# EAGLE design PiTlnfo (EAGLE 6.5.0)
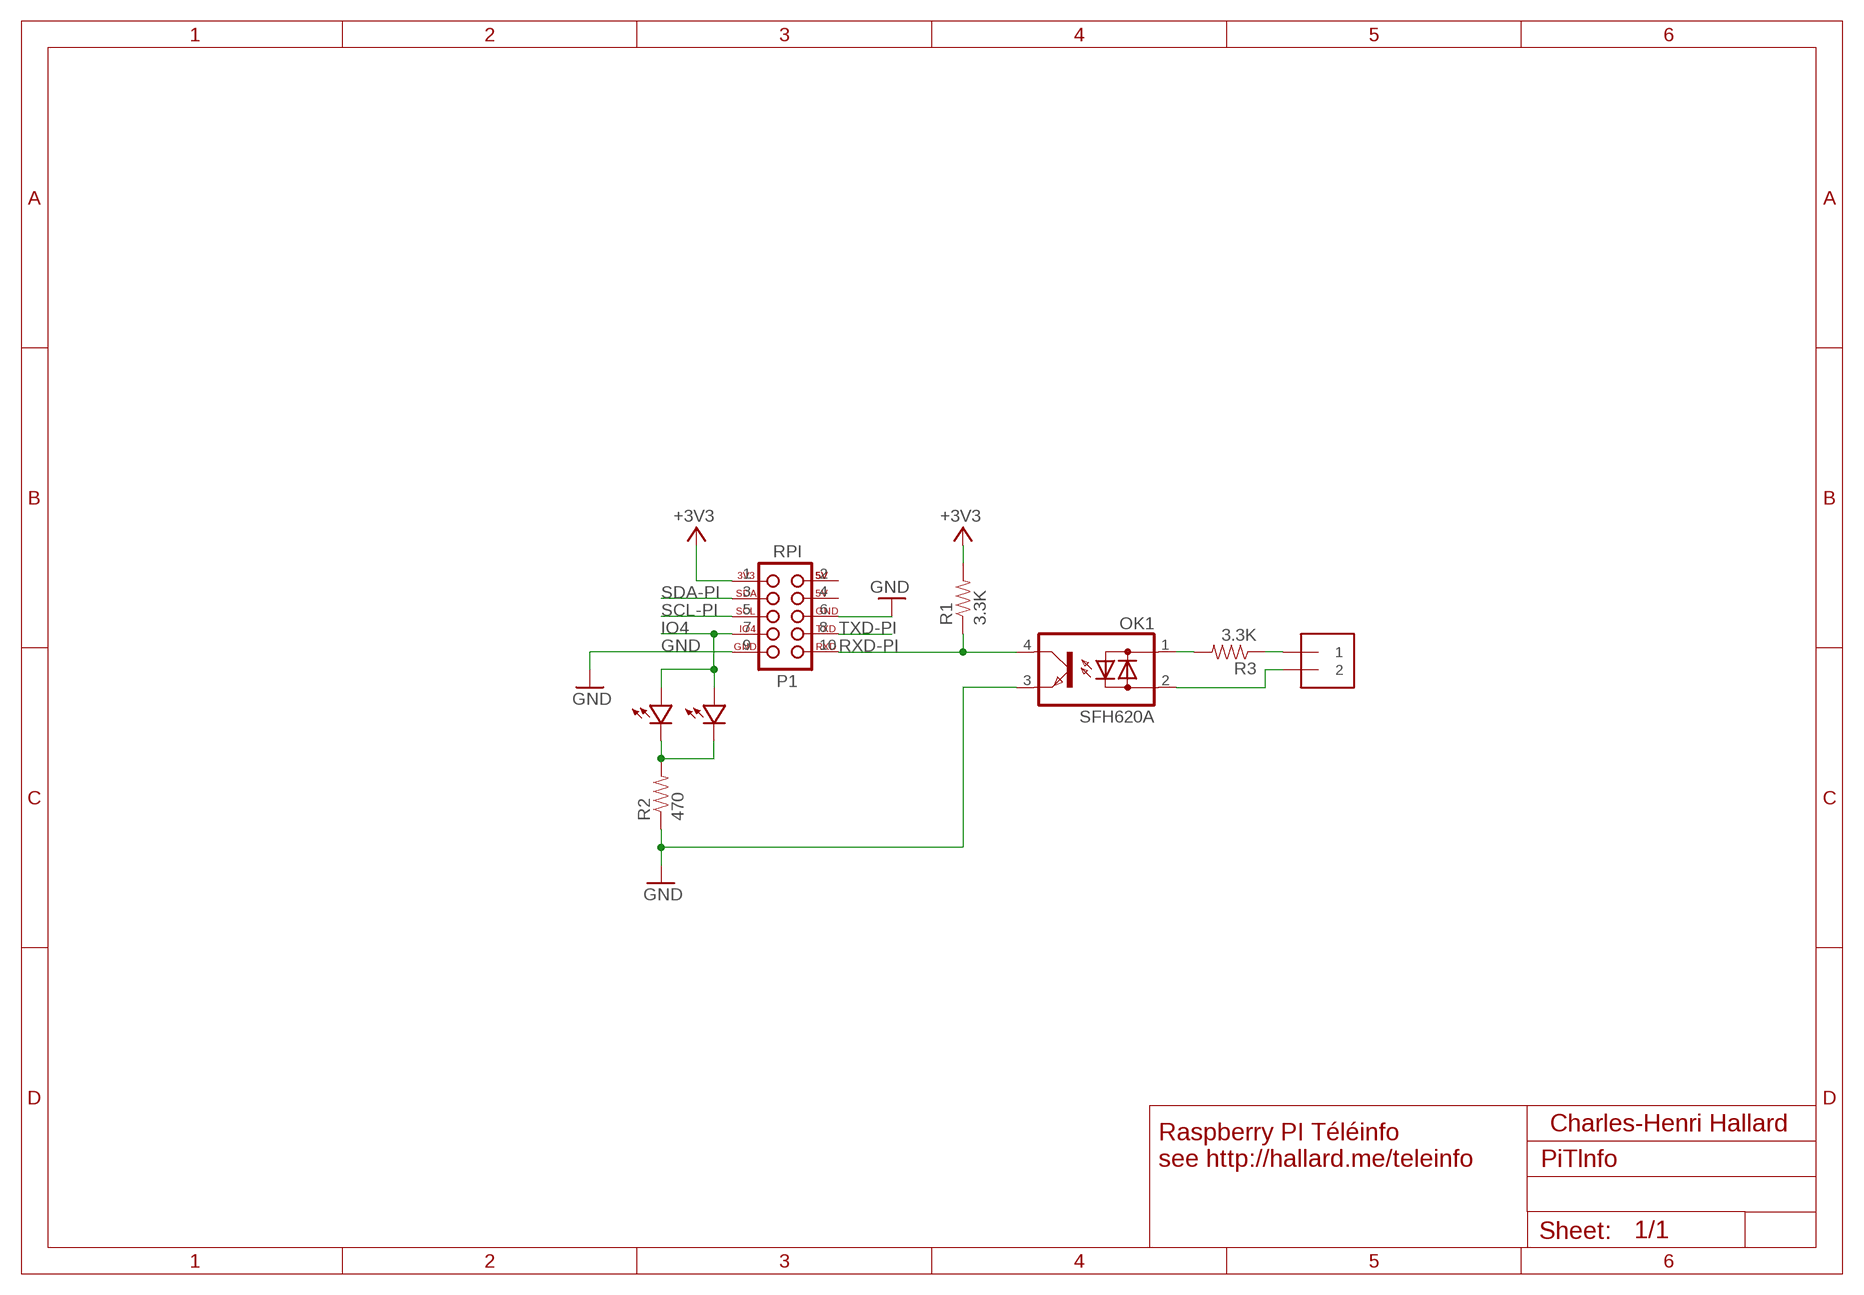
[diagram p0: schematic, sheet 1]

## Parts
J1  1X2-3.5MM  [1X2-3.5MM]
LED1  LED0805-LARGE  [0805-LED-LARGEPADS]
LED3  LED3MM  [LED3MM]
OK1  SFH620A  [DIL04]
R1  3.3K  RESISTORKIT  [AXIAL-0.3-KIT]
R2  470  RESISTORKIT  [AXIAL-0.3-KIT]
R3  3.3K  RESISTORKIT  [AXIAL-0.3-KIT]
U$2  RASPBERRY_PI_2X5  [2X05_LOCK]

## Nets
+3V3 [power]: R1.P$2 U$2.1
GND [power]: OK1.3(E) R2.P$1 U$2.6 U$2.9
IO4: LED1.PLUS LED3.PLUS U$2.7
N$3: LED1.MINUS LED3.MINUS R2.P$2
N$5: J1.2 OK1.2(AC2)
N$6: J1.1 R3.P$1
N$7: OK1.1(AC1) R3.P$2
RXD-PI: OK1.4(C) R1.P$1 U$2.10
SCL-PI: U$2.5
SDA-PI: U$2.3
TXD-PI: U$2.8

## Notes on the sheet
- Charles-Henri Hallard
- Raspberry PI Téléinfo
  see http://hallard.me/teleinfo

## Power pins joined to a net without a drawn wire
2: U$2.2
4: U$2.4

## Library data of the parts
J1 = adafruit:1X2: 3.5mm Terminal block http://www.ladyada.net/library/pcb/eaglelibrary.html
LED1 LED3 = _c2h:LED
OK1 = optocoupler:SFH620: Optocoupler, Phototransistor Output, AC Input Source: http://www.vishay.com/docs/83675/sfh620.pdf; MPN: SFH620A-2; OC_FARNELL: 1469594; OC_NEWARK: 97K9546
R1-R3 = _c2h:RESISTOR: Resistor Basic schematic elements and footprints for 0603, 1206, and PTH resistors.
U$2 = _c2h:RASPBERRY_PI_2X5

## Net classes
0 default: width 0.152 mm, drill 0.356 mm, clearance 0.152 mm
1 power: width 0.203 mm, drill 0.356 mm, clearance 0.152 mm

## Board
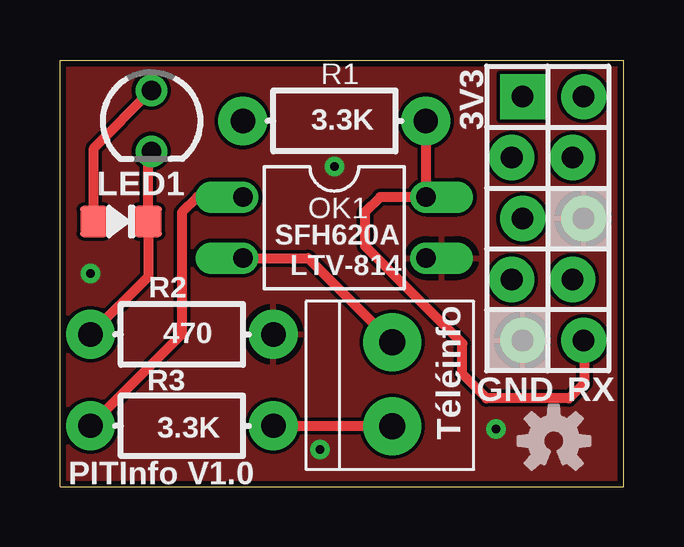
[diagram p1: board, top side]
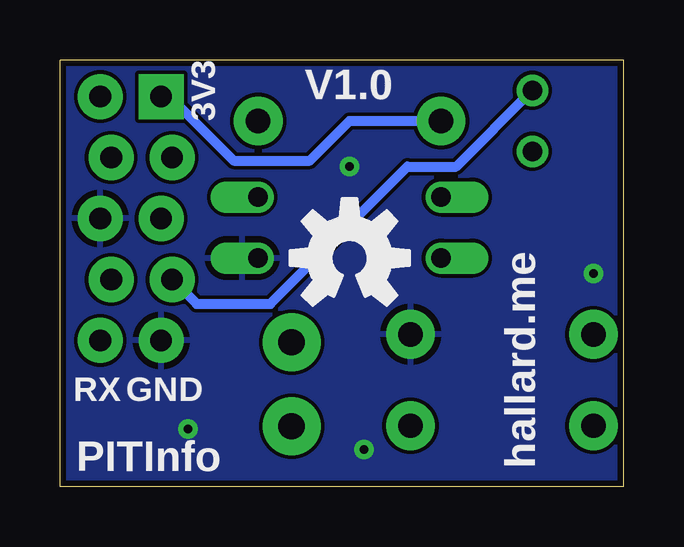
[diagram p2: board, bottom side, seen from below]

Size 23.5 x 17.78 mm. Coordinates in mm from the lower left corner, seen from the top.
Outline: 0,0 0,17.78 23.5,17.78 23.5,0 0,0
Copper layers (1*16): Top 0.035mm / dielectric 1.5mm / Bottom 0.035mm
Design rules "SeeedStudio_2layer_DRU_no_angle_20140221": minimum track width 6mil, minimum drill 12mil, track to track 6mil, track to pad 6mil, pad to pad 6mil, via to via 6mil, smd to smd 0mil, copper to edge 10mil, drill to drill 10mil, minimum pad ring 10mil, minimum via ring 6mil, stop-mask expansion 2mil, vias tented up to drill 100mil, thermal gap 10mil

### Footprints (pad centres in the part's own frame; a part is rotated, then mirrored left to right if it is on the bottom)
1X2-3.5MM = drill 1.1 pad 2.413: 1 1.8,0; 2 -1.7,0
0805-LED-LARGEPADS = smd 1.156 x 1.3: MINUS -1.127,0; PLUS 1.127,0
LED3MM = drill 0.813: MINUS 1.27,0; PLUS -1.27,0
DIL04 = drill 0.813 offset: 1 -1.27,-3.81; 2 1.27,-3.81; 3 1.27,3.81; 4 -1.27,3.81
AXIAL-0.3-KIT = drill 1.016 pad 2.032: P$1 -3.81,0; P$2 3.81,0
2X05_LOCK = drill 0.9 pad 1.88 square: 1 -5.08,-1.041 | drill 0.9 pad 1.88: 2 -5.08,1.499; 3 -2.54,-1.499; 4 -2.54,1.041; 5 0,-1.041; 6 0,1.499; 7 2.54,-1.499; 8 2.54,1.041; 9 5.08,-1.041; 10 5.08,1.499

### Placement (x,y rotation side)
J1  13.84,4.32 270 top
LED1  2.54,11.05 180 top
LED3  3.81,15.24 270 top
OK1  11.43,10.79 270 top
R1  11.43,15.24 180 top
R2  5.08,6.35 180 top
R3  5.08,2.54 180 top
U$1  [OSHW-LOGO-M]  11.43,9.53 0 bottom
U$2  20.32,11.18 270 top
U$3  [OSHW-LOGO-S]  20.57,1.91 0 top

### Tracks (layer width: path | path; a pad name or v marks a point on that pad's centre or on a via)
+3V3
  Bottom 0.406: U$2.1 18.92,16.26 16.26,13.59 13.08,13.59 11.43,15.24 R1.P$2
GND  (via drill 0.36 pad 0.81)
  other vias: 11.43,13.34 18.16,2.41 1.27,8.89 10.83,1.56
  pour Bottom: 0,17.53 24.13,17.65 24.13,-0.25 0,-0.25
  pour Top: 0,-0.25 24.13,-0.25 24.13,17.65 0,17.53
IO4
  Top 0.406: LED1.PLUS 1.41,14.11 LED3.PLUS
  Bottom 0.406: LED3.PLUS 6.99,13.34 9.02,13.34 14.73,7.62 17.8,7.62 U$2.7
N$3
  Top 0.305: 3.67,13.83 LED3.MINUS
  Top 0.406: 3.67,13.83 LED1.MINUS 3.67,8.75 R2.P$2
N$5
  Top 0.406: OK1.2 10.34,9.53 J1.2
N$6
  Top 0.305: 8.91,2.52 R3.P$1
  Top 0.406: J1.1 8.91,2.52
N$7
  Top 0.406: OK1.1 5.71,12.06 5.08,11.43 5.08,6.35 R3.P$2
RXD-PI
  Top 0.305: 21.84,6.07 U$2.10
  Top 0.406: 21.84,6.07 21.84,4.32 21.21,3.68 17.78,3.68 16.76,4.7 16.76,5.97 12.7,10.03 12.7,11.43 13.34,12.06 OK1.4 R1.P$1

### Text on the board
tNames: 3V3 | LTV-814 | Téléinfo | GND | RX | PITInfo V1.0
bNames: 3V3 | V1.0 | GND | RX | hallard.me | PITInfo